# Altium project WIoT_WM01_V100.PrjPcb
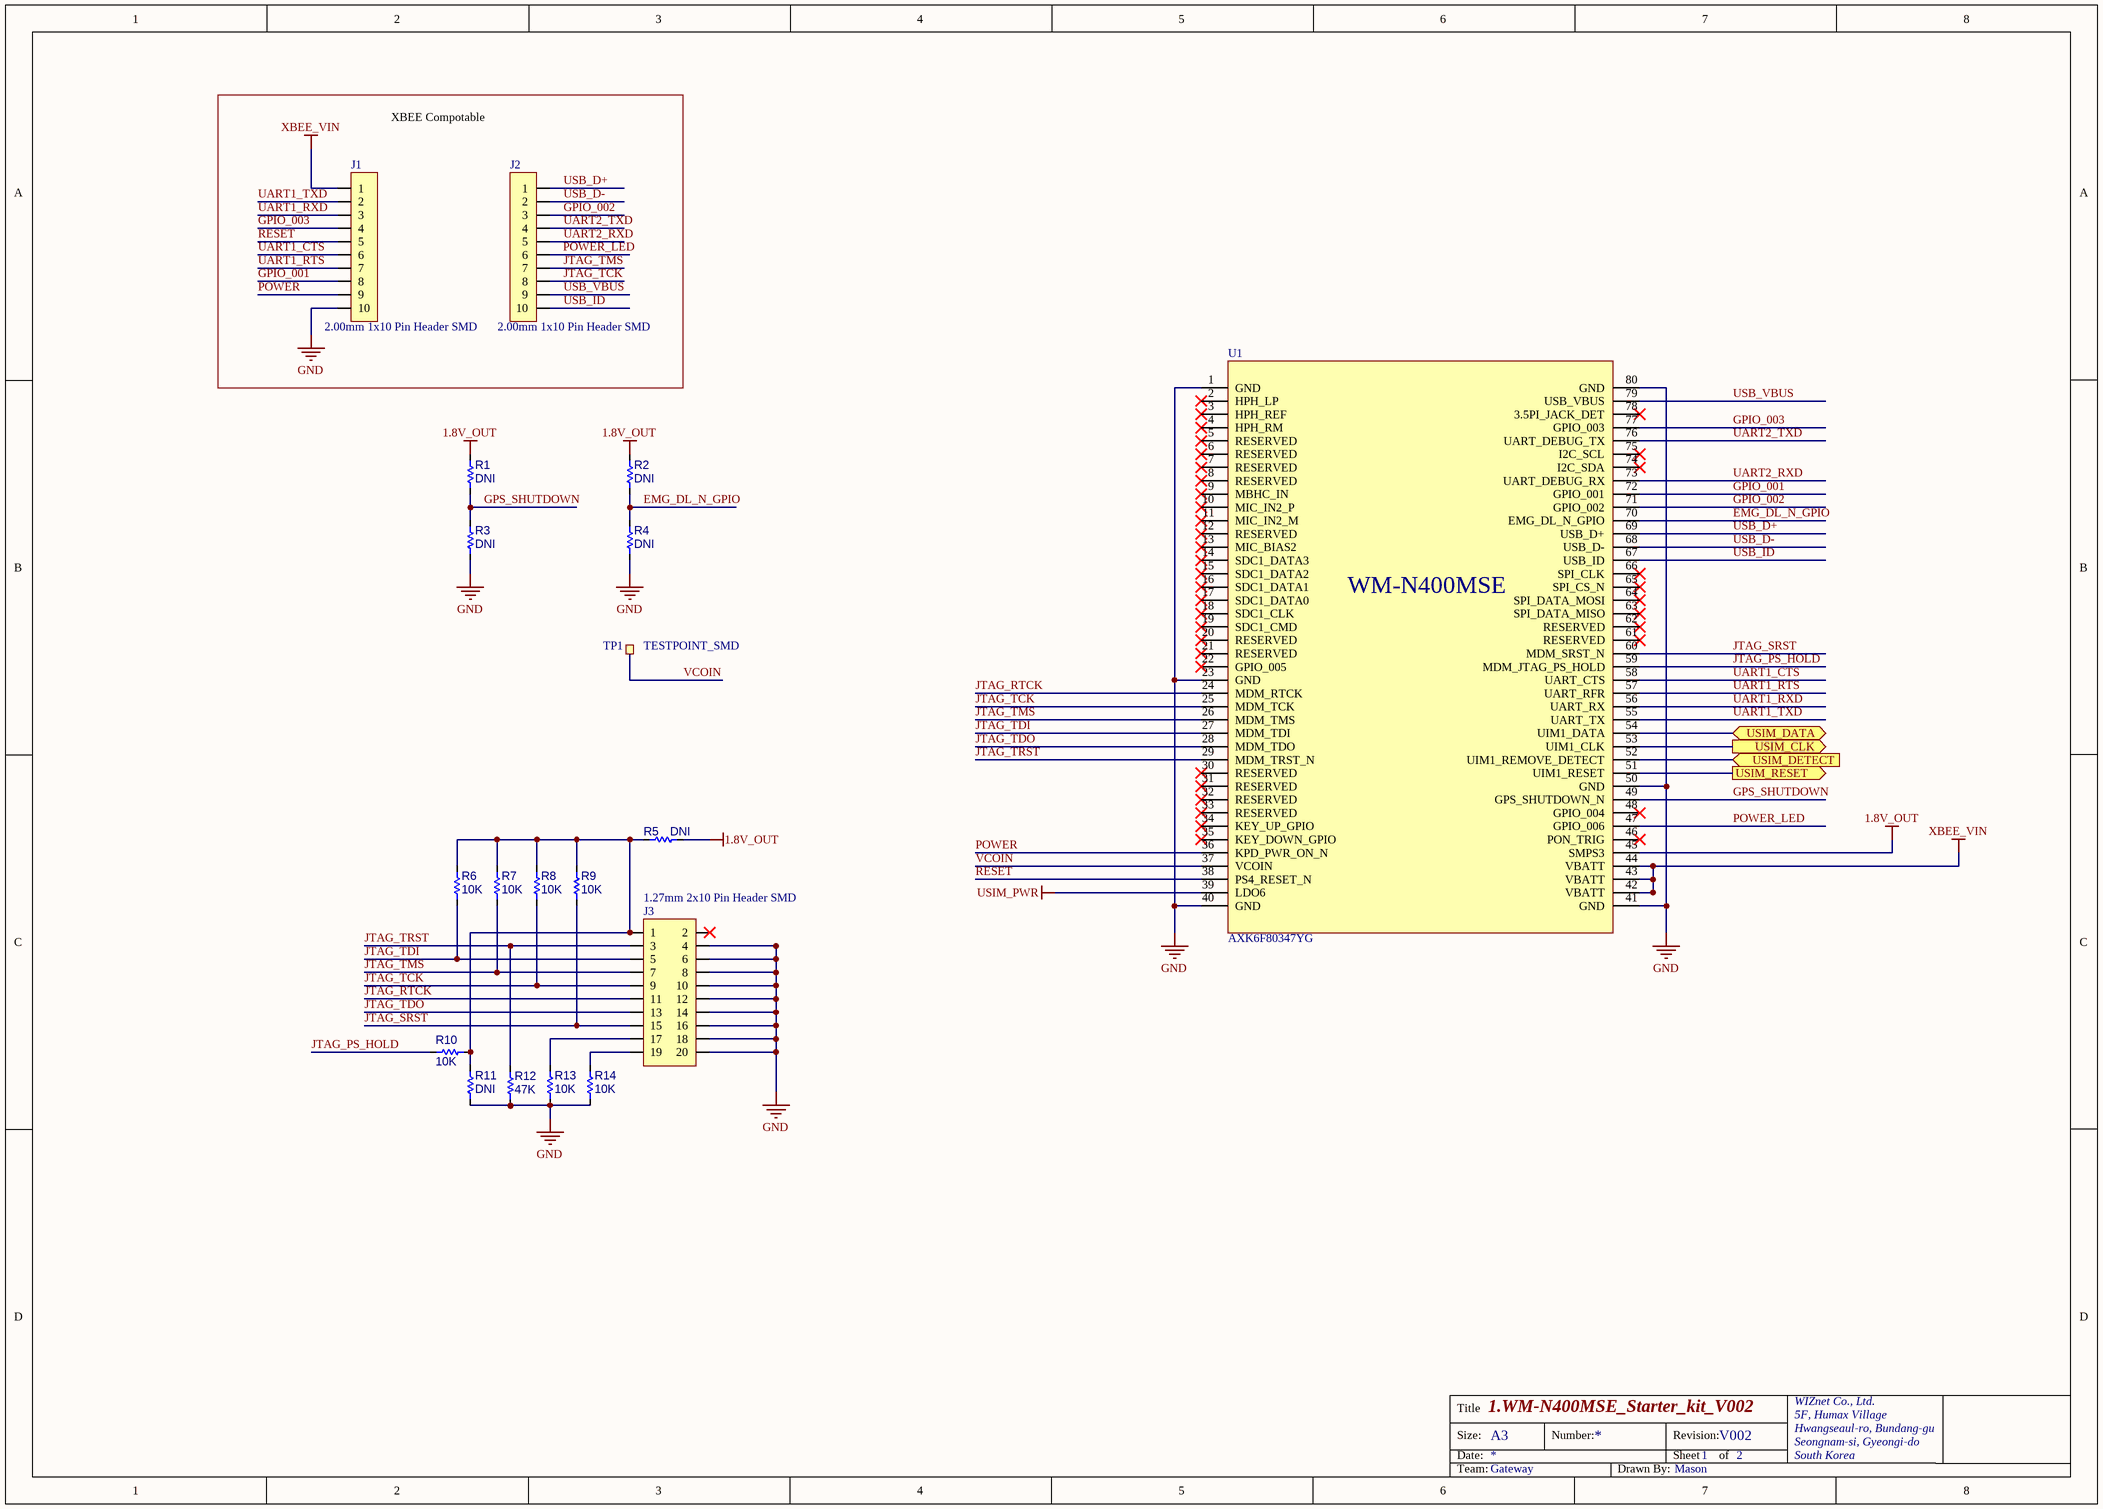
[diagram p0: 1.WM-N400MSE.SchDoc]
2 sheets, 37 parts. Net scope: flat (ports and power ports of the same name join across sheets).
Board file: WIoT_WM01_V100.PcbDoc
Sheets:
  1.WM-N400MSE.SchDoc
  2.SIM.SchDoc

## Sheet 1.WM-N400MSE.SchDoc: 1.WM-N400MSE_Starter_kit_V002
size A3; DrawnBy: Mason; Revision: V002; SheetNumber: 1; SheetTotal: 2; Team: Gateway; ProjectName: WM-N400MSE_Starter_kit_V002

### Parts
J1  2.00mm 1x10 Pin Header SMD  [IDC(SMD)-1X10(2MM)]
J2  2.00mm 1x10 Pin Header SMD  [IDC(SMD)-1X10(2MM)]
J3  1.27mm 2x10 Pin Header SMD  [IDC(SMD)-2X10(1.27MM)]
R1  DNI  [RES-0402]
R2  DNI  [RES-0402]
R3  DNI  [RES-0402]
R4  DNI  [RES-0402]
R5  DNI  [RES-0402]
R6  10K  [RES-0402]
R7  10K  [RES-0402]
R8  10K  [RES-0402]
R9  10K  [RES-0402]
R10  10K  [RES-0402]
R11  DNI  [RES-0402]
R12  47K  [RES-0402]
R13  10K  [RES-0402]
R14  10K  [RES-0402]
TP1  TESTPOINT_SMD  [TP(SMD)-1PI]
U1  AXK6F80347YG  [WM-N400MSE]

### Ports
USIM_CLK (out), USIM_DATA (bidir), USIM_DETECT (in), USIM_RESET (out)

### Nets
1.8V_OUT: R1.2 R2.2 R5.1 U1.45(SMPS3)
GND: J1.10 J3.4 J3.6 J3.8 J3.10 J3.12 J3.14 J3.16 J3.18 J3.20 R3.1 R4.1 R11.1 R12.1 R13.1 R14.1 U1.1(GND) U1.23(GND) U1.40(GND) U1.41(GND) U1.50(GND) U1.80(GND)
USIM_PWR: U1.39(LDO6)
XBEE_VIN: J1.1 U1.42(VBATT) U1.43(VBATT) U1.44(VBATT)
EMG_DL_N_GPIO: R2.1 R4.2 U1.70(EMG_DL_N_GPIO)
GPIO_001: J1.8 U1.72(GPIO_001)
GPIO_002: J2.3 U1.71(GPIO_002)
GPIO_003: J1.4 U1.77(GPIO_003)
GPS_SHUTDOWN: R1.1 R3.2 U1.49(GPS_SHUTDOWN_N)
JTAG_PS_HOLD: R10.2 U1.59(MDM_JTAG_PS_HOLD)
JTAG_RTCK: J3.11 U1.24(MDM_RTCK)
JTAG_SRST: J3.15 R9.1 U1.60(MDM_SRST_N)
JTAG_TCK: J2.8 J3.9 R8.1 U1.25(MDM_TCK)
JTAG_TDI: J3.5 R6.1 U1.27(MDM_TDI)
JTAG_TDO: J3.13 U1.28(MDM_TDO)
JTAG_TMS: J2.7 J3.7 R7.1 U1.26(MDM_TMS)
JTAG_TRST: J3.3 R12.2 U1.29(MDM_TRST_N)
POWER: J1.9 U1.36(KPD_PWR_ON_N)
POWER_LED: J2.6 U1.47(GPIO_006)
RESET: J1.5 U1.38(PS4_RESET_N)
UART1_CTS: J1.6 U1.58(UART_CTS)
UART1_RTS: J1.7 U1.57(UART_RFR)
UART1_RXD: J1.3 U1.56(UART_RX)
UART1_TXD: J1.2 U1.55(UART_TX)
UART2_RXD: J2.5 U1.73(UART_DEBUG_RX)
UART2_TXD: J2.4 U1.76(UART_DEBUG_TX)
USB_D+: J2.1 U1.69(USB_D+)
USB_D-: J2.2 U1.68(USB_D-)
USB_ID: J2.10 U1.67(USB_ID)
USB_VBUS: J2.9 U1.79(USB_VBUS)
VCOIN: TP1.1(TETSPOINT) U1.37(VCOIN)
NetJ3_1: J3.1 R5.2 R6.2 R7.2 R8.2 R9.2 R10.1 R11.2
NetJ3_17: J3.17 R13.2
NetJ3_19: J3.19 R14.2
NetR15_1: U1.51(UIM1_RESET) ; port USIM_RESET
NetR16_1: U1.53(UIM1_CLK) ; port USIM_CLK
NetR17_1: U1.54(UIM1_DATA) ; port USIM_DATA
NetR18_2: U1.52(UIM1_REMOVE_DETECT) ; port USIM_DETECT

Not connected (* = marked no-connect by the designer): J3 2*; U1 2(HPH_LP)* 3(HPH_REF)* 4(HPH_RM)* 5(RESERVED)* 6(RESERVED)* 7(RESERVED)* 8(RESERVED)* 9(MBHC_IN)* 10(MIC_IN2_P)* 11(MIC_IN2_M)* 12(RESERVED)* 13(MIC_BIAS2)* 14(SDC1_DATA3)* 15(SDC1_DATA2)* 16(SDC1_DATA1)* 17(SDC1_DATA0)* 18(SDC1_CLK)* 19(SDC1_CMD)* 20(RESERVED)* 21(RESERVED)* 22(GPIO_005)* 30(RESERVED)* 31(RESERVED)* 32(RESERVED)* 33(RESERVED)* 34(KEY_UP_GPIO)* 35(KEY_DOWN_GPIO)* 46(PON_TRIG)* 48(GPIO_004)* 61(RESERVED)* 62(RESERVED)* 63(SPI_DATA_MISO)* 64(SPI_DATA_MOSI)* 65(SPI_CS_N)* 66(SPI_CLK)* 74(I2C_SDA)* 75(I2C_SCL)* 78(3.5PI_JACK_DET)*

### Notes on the sheet
- XBEE Compotable
- Title
- Size:
- Date:
- A3
- Number:
- Revision:
- Sheet
- of
- WIZnet Co., Ltd.
- 5F, Humax Village
- Hwangseaul-ro, Bundang-gu
- Seongnam-si, Gyeongi-do
- South Korea
- Team:
- Drawn By:

### Library data of the parts
R1-R14 = RES-0402
TP1 = TESTPOINT_SMD: TEST POINT
U1 = WM-N400MSE

## Sheet 2.SIM.SchDoc: 2.SIM_Interface
size A4; DrawnBy: Mason; Revision: V002; SheetNumber: 2; SheetTotal: 2; Team: Gateway; ProjectName: WM-N400MSE_Starter_kit_V002
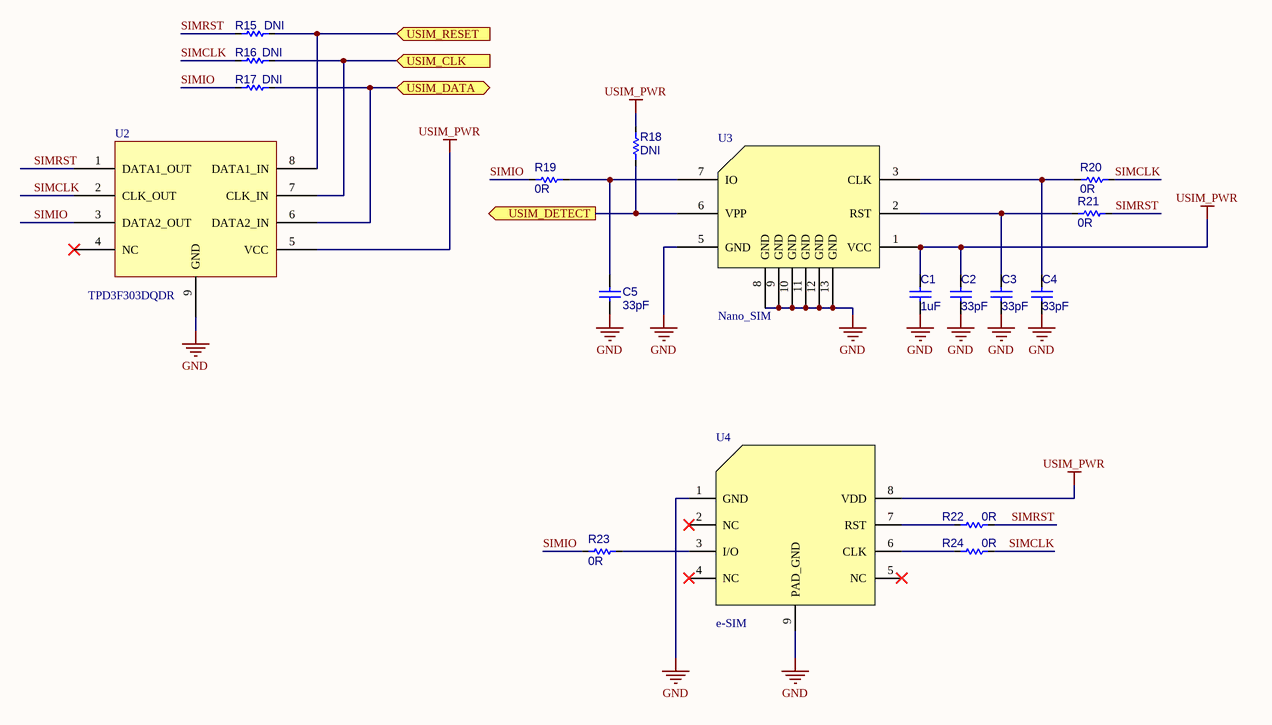
[diagram p1: 2.SIM.SchDoc]

### Parts
C1  1uF  [CAP-0402]
C2  33pF  [CAP-0402]
C3  33pF  [CAP-0402]
C4  33pF  [CAP-0402]
C5  33pF  [CAP-0402]
R15  DNI  [RES-0402]
R16  DNI  [RES-0402]
R17  DNI  [RES-0402]
R18  DNI  [RES-0402]
R19  0R  [RES-0402]
R20  0R  [RES-0402]
R21  0R  [RES-0402]
R22  0R  [RES-0402]
R23  0R  [RES-0402]
R24  0R  [RES-0402]
U2  TPD3F303DQDR  [PWSON08(0.4/1.45X1.8)]
U3  Nano_SIM  [693-043-020-611]
U4  e-SIM  [e-SIM]

### Ports
USIM_CLK (in), USIM_DATA (bidir), USIM_DETECT (out), USIM_RESET (in)

### Nets
GND: C1.1 C2.1 C3.1 C4.1 C5.1 U2.9(GND) U3.5(GND) U3.8(GND) U3.9(GND) U3.10(GND) U3.11(GND) U3.12(GND) U3.13(GND) U4.1(GND) U4.9(PAD_GND)
USIM_PWR: C1.2 C2.2 R18.1 U2.5(VCC) U3.1(VCC) U4.8(VDD)
SIMCLK: R16.2 R20.2 R24.2 U2.2(CLK_OUT)
SIMIO: R17.2 R19.1 R23.1 U2.3(DATA2_OUT)
SIMRST: R15.2 R21.2 R22.2 U2.1(DATA1_OUT)
NetC3_2: C3.2 R21.1 U3.2(RST)
NetC4_2: C4.2 R20.1 U3.3(CLK)
NetC5_2: C5.2 R19.2 U3.7(IO)
NetR15_1: R15.1 U2.8(DATA1_IN) ; port USIM_RESET
NetR16_1: R16.1 U2.7(CLK_IN) ; port USIM_CLK
NetR17_1: R17.1 U2.6(DATA2_IN) ; port USIM_DATA
NetR18_2: R18.2 U3.6(VPP) ; port USIM_DETECT
NetR22_1: R22.1 U4.7(RST)
NetR23_2: R23.2 U4.3(I/O)
NetR24_1: R24.1 U4.6(CLK)

Not connected (* = marked no-connect by the designer): U2 4(NC)*; U4 2(NC)* 4(NC)* 5(NC)*

### Notes on the sheet
- Title
- Size:
- Date:
- A4
- Number:
- Revision:
- Sheet
- of
- WIZnet Co., Ltd.
- 5F, Humax Village
- Hwangseaul-ro, Bundang-gu
- Seongnam-si, Gyeongi-do
- South Korea
- Team:
- Drawn By:

### Library data of the parts
C1-C5 = CAP-0402: Ceramic CAP 0402(1005)
R15-R24 = RES-0402
U2 = TPD3F303DQDR: ESD Protection SIM
U3 = Nano_SIM: Nano SIM SMT 1.2mm Push/Pull

## Nets that join several sheets
GND: 1.WM-N400MSE (22 pins), 2.SIM (15 pins)
USIM_PWR: 1.WM-N400MSE (U1.39), 2.SIM (6 pins)
NetR15_1: 1.WM-N400MSE (U1.51), 2.SIM (R15.1 U2.8)
NetR16_1: 1.WM-N400MSE (U1.53), 2.SIM (R16.1 U2.7)
NetR17_1: 1.WM-N400MSE (U1.54), 2.SIM (R17.1 U2.6)
NetR18_2: 1.WM-N400MSE (U1.52), 2.SIM (R18.2 U3.6)